# EAGLE design Spec-Sensor-breakout (EAGLE 8.2.2)
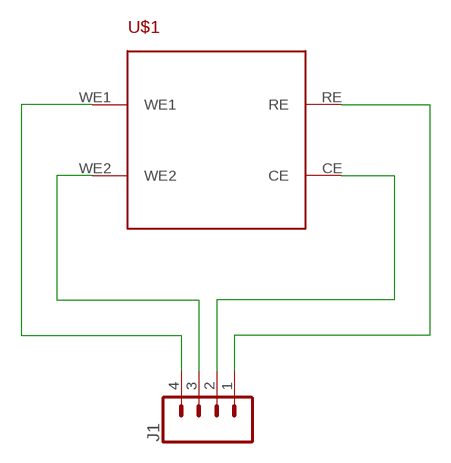
[diagram p0: schematic, sheet 1]

## Parts
J1  CONN_04  [1X04]
U$1  3SP_CO  [3SP_CO_PIN_PACKAGE]

## Nets
N$1: J1.4 U$1.WE1
N$2: J1.3 U$1.WE2
N$3: J1.2 U$1.CE
N$4: J1.1 U$1.RE

## Library data of the parts
J1 = SparkFun-Connectors:CONN_04: Multi connection point. Often used as Generic Header-pin footprint for 0.1 inch spaced/style header connections On any of the 0.1 inch spaced packages, you can populate with these: Break Away Headers - Straight <https://www.sparkfun.com/products/116> (PRT-00116) Break Away Male Headers - Right Angle <https://www.sparkfun.com/products/553> (PRT-00553) Female Headers <https://www.sparkfun.com/products/115> (PRT-00115) Break Away Headers - Machine Pin <https://www.sparkfun.com/products/117> (PRT-00117) Break Away Female Headers - Swiss Machine Pin <https://www.sparkfun.com/products/743> (PRT-00743) For SCREWTERMINALS and SPRING TERMINALS visit here: Screw Terimnals on SparkFun.com <https://www.sparkfun.com/search/results?term=Screw+Terminals> (5mm/3.5mm/2.54mm spacing) This device is also useful as a general connection point to wire up your design to another part of your project. Our various solder wires solder well into these plated through hole pads. Hook-Up Wire - Assortment (Stranded, 22 AWG) <https://www.sparkfun.com/products/11375> (PRT-11375) Hook-Up Wire - Assortment (Solid Core, 22 AWG) <https://www.sparkfun.com/products/11367> (PRT-11367) View the entire wire category on our website here <https://www.sparkfun.com/categories/141> Special notes: Molex polarized connector foot print use with SKU : PRT-08231 with associated crimp pins and housings. 1MM SMD Version SKU: PRT-10208; PROD_ID: CONN-09696
U$1 = 3SP_CO:3SP_CO: Spec sensors - CO - Carbon Monoxide Sensor 1000 ppm Pinned Package http://www.spec-sensors.com/product/co-carbon-monoxide-sensor-1000-ppm/ Eagle symbol and footprint designed by Akram Ali https://github.com/AKstudios October 2016

## Board
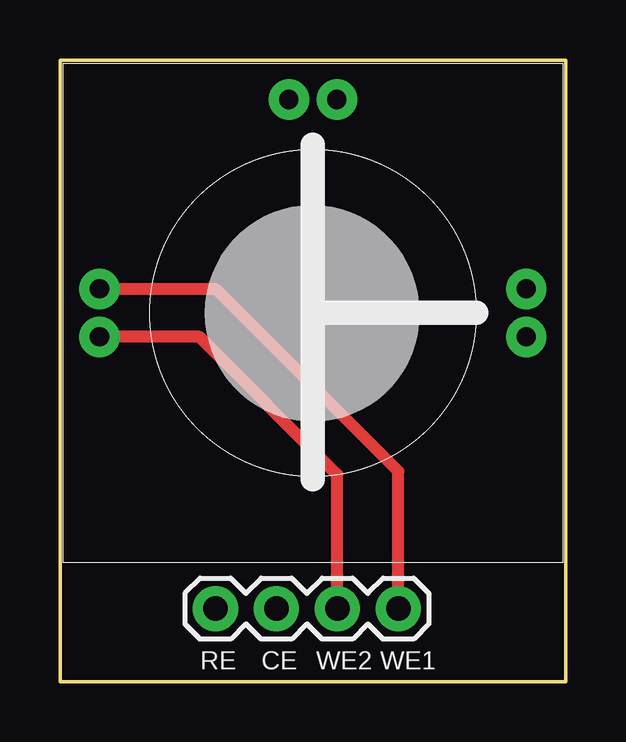
[diagram p1: board, top side]
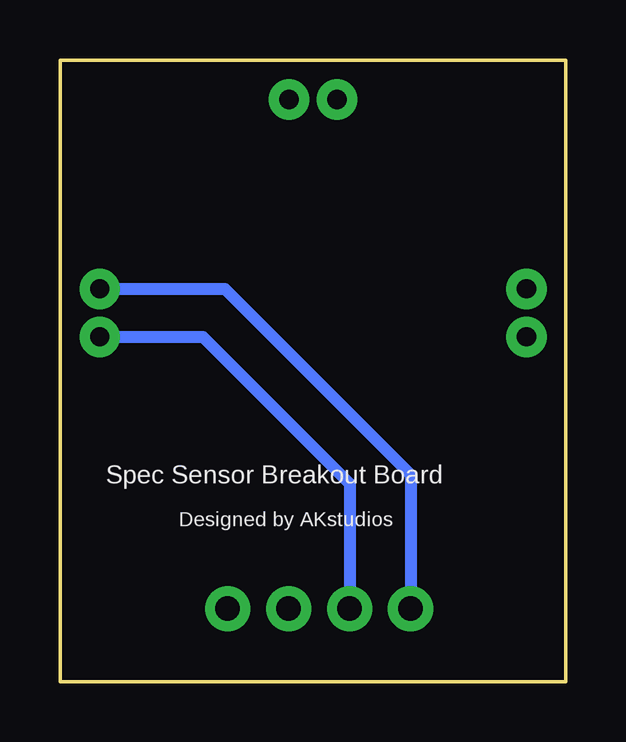
[diagram p2: board, bottom side, seen from below]

Size 21.08 x 25.91 mm. Coordinates in mm from the lower left corner, seen from the top.
Outline: 0,25.91 0,0 21.08,0 21.08,25.91 0,25.91
Copper layers (1*16): Top 0.035mm / dielectric 1.5mm / Bottom 0.035mm
Design rules "default": minimum track width 6mil, minimum drill 0.35mm, track to track 6mil, track to pad 6mil, pad to pad 6mil, via to via 6mil, smd to smd 6mil, copper to edge 40mil, drill to drill 6mil, minimum pad ring 10mil, minimum via ring 8mil, stop-mask expansion 4mil, vias tented up to drill 0mil, thermal gap 10mil

### Footprints (pad centres in the part's own frame; a part is rotated, then mirrored left to right if it is on the bottom)
1X04 = drill 1.016 pad 1.88: 1 0,0; 2 2.54,0; 3 5.08,0; 4 7.62,0
3SP_CO_PIN_PACKAGE = drill 0.8 pad 1.676: CE 11.41,19.3; P$3 1.52,11.41; P$4 1.52,9.41; RE 9.41,19.3; WE1 9.41,1.52; WE2 11.41,1.52

### Placement (x,y rotation side)
J1  6.48,3.05 0 top
U$1  0.13,25.78 270 top

### Tracks (layer width: path | path; a pad name or v marks a point on that pad's centre or on a via)
N$1
  Top 0.508: U$1.WE1 6.49,16.37 14.1,8.76 J1.4
N$2
  Top 0.508: U$1.WE2 5.82,14.37 11.56,8.64 J1.3
N$3
  Bottom 0.508: J1.2 9.02,8.25 15.13,14.37 U$1.CE
N$4
  Bottom 0.508: J1.1 6.48,8.64 14.21,16.37 U$1.RE

### Text on the board
tPlace: RE | CE | WE2 | WE1
bPlace: Spec Sensor Breakout Board | Designed by AKstudios